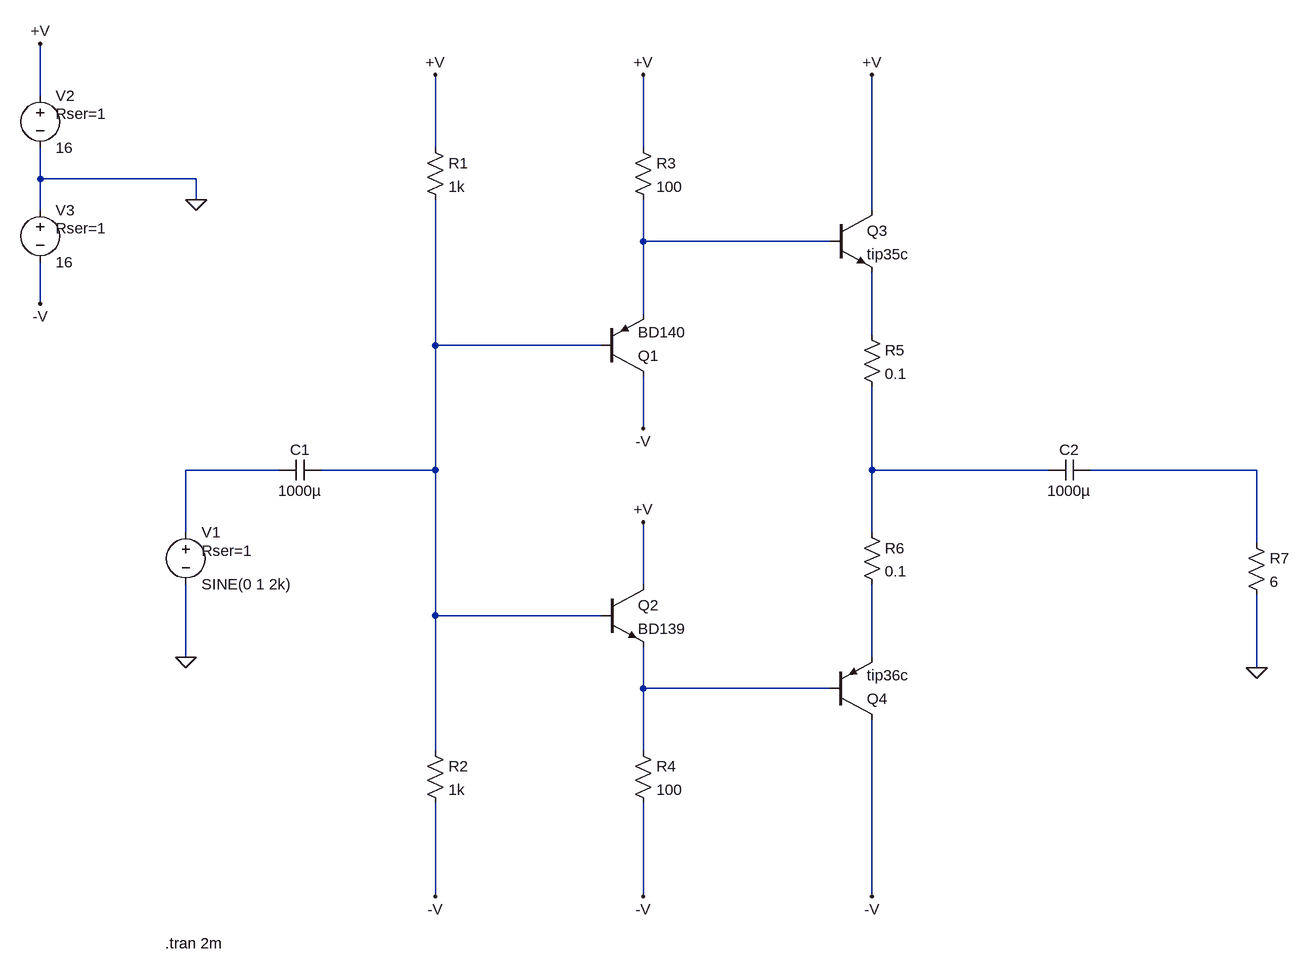
[diagram p0: schematic power stage.asc]
power stage.asc, the LTspice schematic file:
Version 4
SHEET 1 1560 680
WIRE -368 -1104 -368 -1184
WIRE 240 -1024 240 -1136
WIRE 560 -1024 560 -1136
WIRE -368 -976 -368 -1024
WIRE -128 -976 -368 -976
WIRE -128 -944 -128 -976
WIRE -368 -928 -368 -976
WIRE 912 -928 912 -1136
WIRE 560 -880 560 -944
WIRE 848 -880 560 -880
WIRE -368 -784 -368 -848
WIRE 560 -768 560 -880
WIRE 912 -736 912 -832
WIRE 240 -720 240 -944
WIRE 496 -720 240 -720
WIRE 560 -592 560 -672
WIRE 0 -528 -144 -528
WIRE 240 -528 240 -720
WIRE 240 -528 64 -528
WIRE 912 -528 912 -656
WIRE 1184 -528 912 -528
WIRE 1504 -528 1248 -528
WIRE -144 -432 -144 -528
WIRE 912 -432 912 -528
WIRE 1504 -416 1504 -528
WIRE 560 -352 560 -448
WIRE 240 -304 240 -528
WIRE 496 -304 240 -304
WIRE -144 -240 -144 -352
WIRE 912 -240 912 -352
WIRE 1504 -224 1504 -336
WIRE 560 -192 560 -256
WIRE 848 -192 560 -192
WIRE 240 -96 240 -304
WIRE 560 -96 560 -192
WIRE 240 128 240 -16
WIRE 560 128 560 -16
WIRE 912 128 912 -144
FLAG -144 -240 0
FLAG 240 -1136 +V
FLAG 560 -1136 +V
FLAG 240 128 -V
FLAG 560 128 -V
FLAG 560 -592 -V
FLAG 560 -448 +V
FLAG 912 -1136 +V
FLAG 912 128 -V
FLAG 1504 -224 0
FLAG -368 -1184 +V
FLAG -368 -784 -V
FLAG -128 -944 0
SYMBOL cap 64 -544 R90
WINDOW 0 0 32 VBottom 2
WINDOW 3 32 32 VTop 2
SYMATTR InstName C1
SYMATTR Value 1000µ
SYMBOL res 224 -1040 R0
SYMATTR InstName R1
SYMATTR Value 1k
SYMATTR SpiceLine tol=1 pwr=0.5
SYMBOL res 224 -112 R0
SYMATTR InstName R2
SYMATTR Value 1k
SYMATTR SpiceLine tol=1 pwr=0.5
SYMBOL pnp 496 -672 M180
SYMATTR InstName Q1
SYMATTR Value BD140
SYMBOL npn 496 -352 R0
SYMATTR InstName Q2
SYMATTR Value BD139
SYMBOL voltage -144 -448 R0
WINDOW 123 0 0 Left 0
WINDOW 39 24 44 Left 2
SYMATTR SpiceLine Rser=1
SYMATTR InstName V1
SYMATTR Value SINE(0 1 2k)
SYMBOL res 544 -1040 R0
SYMATTR InstName R3
SYMATTR Value 100
SYMATTR SpiceLine tol=5 pwr=2
SYMBOL res 544 -112 R0
SYMATTR InstName R4
SYMATTR Value 100
SYMATTR SpiceLine tol=5 pwr=5
SYMBOL npn 848 -928 R0
SYMATTR InstName Q3
SYMATTR Value tip35c
SYMBOL pnp 848 -144 M180
SYMATTR InstName Q4
SYMATTR Value tip36c
SYMBOL res 896 -752 R0
SYMATTR InstName R5
SYMATTR Value 0.1
SYMBOL res 896 -448 R0
SYMATTR InstName R6
SYMATTR Value 0.1
SYMBOL res 1488 -432 R0
SYMATTR InstName R7
SYMATTR Value 6
SYMBOL voltage -368 -1120 R0
WINDOW 123 0 0 Left 0
WINDOW 39 24 44 Left 2
SYMATTR SpiceLine Rser=1
SYMATTR InstName V2
SYMATTR Value 16
SYMBOL voltage -368 -944 R0
WINDOW 123 0 0 Left 0
WINDOW 39 24 44 Left 2
SYMATTR SpiceLine Rser=1
SYMATTR InstName V3
SYMATTR Value 16
SYMBOL cap 1248 -544 R90
WINDOW 0 0 32 VBottom 2
WINDOW 3 32 32 VTop 2
SYMATTR InstName C2
SYMATTR Value 1000µ
TEXT -176 200 Left 2 !.tran 2m

The netlist it stands for:
* power stage.asc
C1 N003 N004 1000µ
R1 +V N003 1k tol=1 pwr=0.5
R2 N003 -V 1k tol=1 pwr=0.5
Q1 -V N003 N001 0 BD140
Q2 +V N003 N008 0 BD139
V1 N004 0 SINE(0 1 2k) Rser=1
R3 +V N001 100 tol=5 pwr=2
R4 N008 -V 100 tol=5 pwr=5
Q3 +V N001 N002 0 tip35c
Q4 -V N008 N007 0 tip36c
R5 N002 N005 0.1
R6 N005 N007 0.1
R7 N006 0 6
V2 +V 0 16 Rser=1
V3 0 -V 16 Rser=1
C2 N006 N005 1000µ
.model NPN NPN
.model PNP PNP
.lib standard.bjt
.tran 2m
.backanno
.end